# Altium project PCB_Project.PrjPcb
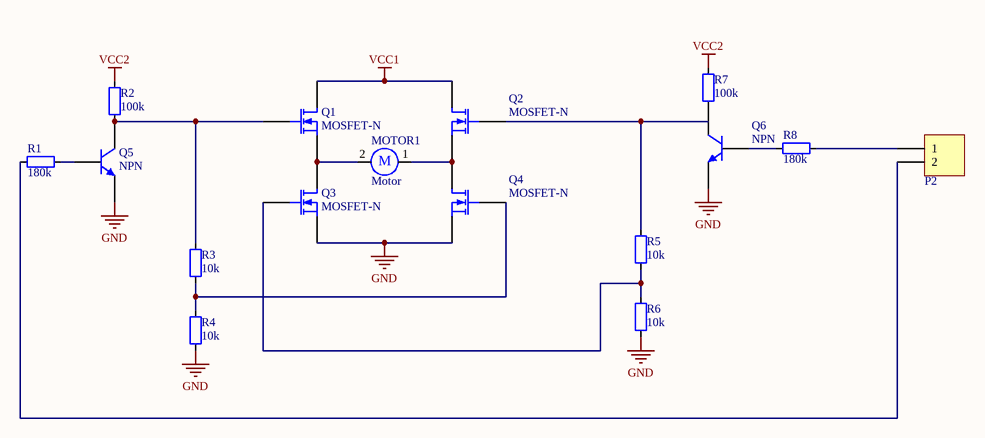
[diagram p0: MostekH.SchDoc]
1 sheet, 16 parts. Net scope: global (net labels, ports and power ports of the same name join across sheets).
Board file: Mostek.PcbDoc

## Sheet MostekH.SchDoc: MostekH
size A4; Author: Grzegorz Pietrzykowski; Revision: v1

### Parts
MOTOR1  Motor  [HDR1X2]
P2  HDR1X2  [HDR1X2]  (value not drawn)
Q1  MOSFET-N  [E3]
Q2  MOSFET-N  [E3]
Q3  MOSFET-N  [E3]
Q4  MOSFET-N  [E3]
Q5  NPN  [TO-226-AA]
Q6  NPN  [TO-226-AA]
R1  180k  [RESC0402]
R2  100k  [RESC0402]
R3  10k  [RESC0402]
R4  10k  [RESC0402]
R5  10k  [RESC0402]
R6  10k  [RESC0402]
R7  100k  [RESC0402]
R8  180k  [RESC0402]

### Nets
GND: Q3.3(S) Q4.3(S) Q5.3(E) Q6.3(E) R4.1 R6.1
VCC1: Q1.1(D) Q2.1(D)
VCC2: R2.2 R7.2
NetMOTOR1_1: MOTOR1.1 Q2.3(S) Q4.1(D)
NetMOTOR1_2: MOTOR1.2 Q1.3(S) Q3.1(D)
NetP2_1: P2.1 R8.1
NetP2_2: P2.2 R1.2
NetQ1_2: Q1.2(G) Q5.1(C) R2.1 R3.2
NetQ2_2: Q2.2(G) R5.2
NetQ3_2: Q3.2(G) R5.1 R6.2
NetQ4_2: Q4.2(G) R3.1 R4.2
NetQ5_2: Q5.2(B) R1.1
NetQ6_1: Q6.1(C) R7.1
NetQ6_2: Q6.2(B) R8.2

### Notes on the sheet
- (in symbol Motor) M

### Library data of the parts
MOTOR1 = Motor: Motor, General Kind; Published: 24-Mar-1999; LatestRevisionDate: 17-Jul-2002; LatestRevisionNote: Re-released for DXP Platform.; PackageReference: RB5-10.5; Publisher: Altium Limited
P2 = HDR1X2: Header, 2-Pin; LatestRevisionDate: 17-Jul-2002; LatestRevisionNote: Re-released for DXP Platform.; Publisher: Altium Limited
Q1-Q4 = MOSFET-N: N-Channel MOSFET; Published: 8-Jun-2000; LatestRevisionDate: 17-Jul-2002; LatestRevisionNote: Re-released for DXP Platform.; PackageVersion: 1995/1996; PackageReference: E3; Publisher: Altium Limited; PackageDescription: TO, Flat Index; 3 In-Line, Axial Leads; Body Dia. 4.6mm; Lead Dia. 0.5 mm (max)
Q5 Q6 = NPN: NPN Bipolar Transistor; Published: 8-Jun-2000; LatestRevisionDate: 17-Jul-2002; LatestRevisionNote: Re-released for DXP Platform.; PackageReference: TO-226-AA; Publisher: Altium Limited; PackageDescription: TO, Flat Index; 3 In-Line, Axial Leads; Body Dia. 4.8mm; Leads 0.55 x 0.51 mm (max); Code_JEDEC: TO-226-AA
R1-R8 = RES: Resistior
  R1 R8: Value: 180k
  R2 R7: Value: 100k
  R3-R6: Value: 10k